# Altium schematic sheet DXP格式 单片机万年历LCD12864显示.SchDoc
size A4
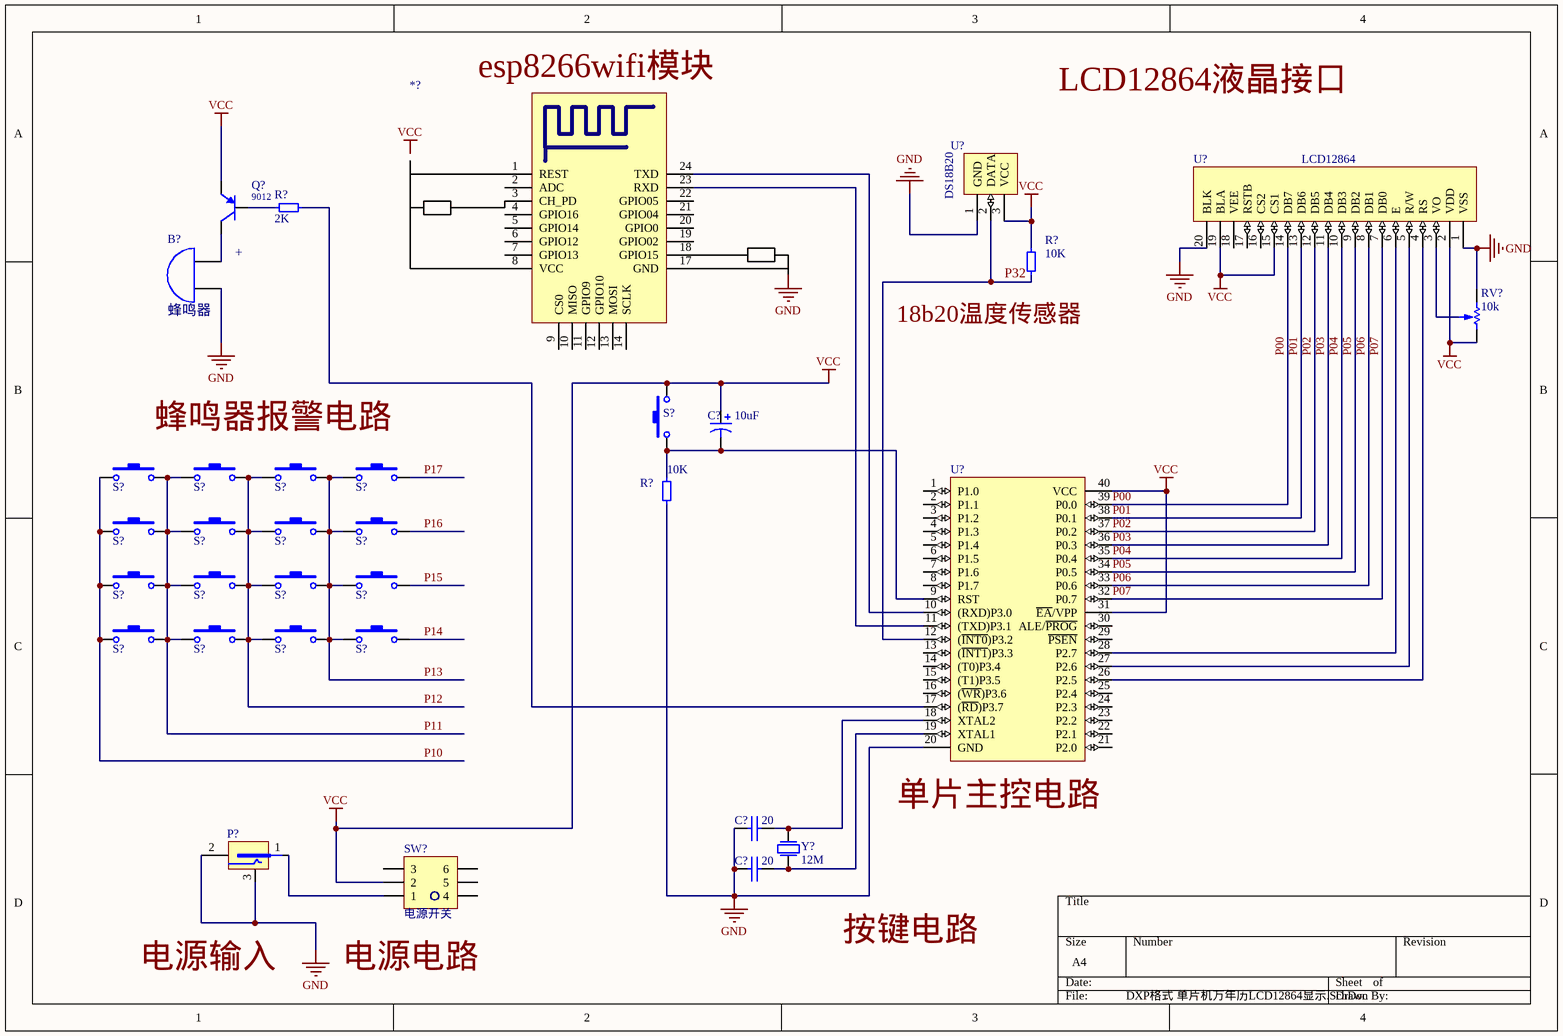
[diagram p0: DXP格式 单片机万年历LCD12864显示.SchDoc]

## Parts
(Parts that share a designator on the sheet are numbered #1, #2 ... from top to bottom, then left to right.)
*?  esp8266wifi模块
B?  蜂鸣器  [Bett]
C?#1  10uF  [C_10]
C?#2  20  [CAP5]
C?#3  20  [CAP5]
P?  电源输入  [DC2.1]  (value not drawn)
Q?  9012  [s三极管直插]
R?#1  2K  [AXIAL0.3]
R?#2  10K  [AXIAL0.3]
R?#3  10K  [res400mil]
RV?  value 10k  [可调电阻器]  (hidden comment: R)
S?#1  SW-PB  [key]  (value not drawn)
S?#2  SW-PB  [key]  (value not drawn)
S?#3  SW-PB  [key]  (value not drawn)
S?#4  SW-PB  [key]  (value not drawn)
S?#5  SW-PB  [key]  (value not drawn)
S?#6  SW-PB  [key]  (value not drawn)
S?#7  SW-PB  [key]  (value not drawn)
S?#8  SW-PB  [key]  (value not drawn)
S?#9  SW-PB  [key]  (value not drawn)
S?#10  SW-PB  [key]  (value not drawn)
S?#11  SW-PB  [key]  (value not drawn)
S?#12  SW-PB  [key]  (value not drawn)
S?#13  SW-PB  [key]  (value not drawn)
S?#14  SW-PB  [key]  (value not drawn)
S?#15  SW-PB  [key]  (value not drawn)
S?#16  SW-PB  [key]  (value not drawn)
S?#17  SW-PB  [key]  (value not drawn)
SW?  电源开关  [sw_自锁 1]
U?#1  DS18B20  [18B20]
U?#2  LCD12864  [SIP20]
U?#3  STC89C52  [DIP40 - 做板]  (value not drawn)
Y?  12M  [XTAL]

## Nets
GND: B?.2(B) C?#2.1 C?#3.1 P?.2 P?.3 R?#3.1 RV?.3 U?#1.1(GND) U?#2.1(VSS) U?#2.20(BLK) U?#3.20(GND)
VCC: C?#1.1 Q?.1(E) R?#2.2 RV?.1 S?#1.2 SW?.2 U?#1.3(VCC) U?#2.2(VDD) U?#2.15(CS1) U?#2.19(BLA) U?#3.31(~{EA}/VPP) U?#3.40(VCC)
P00: U?#2.14(DB7) U?#3.39(P0.0)
P01: U?#2.13(DB6) U?#3.38(P0.1)
P02: U?#2.12(DB5) U?#3.37(P0.2)
P03: U?#2.11(DB4) U?#3.36(P0.3)
P04: U?#2.10(DB3) U?#3.35(P0.4)
P05: U?#2.9(DB2) U?#3.34(P0.5)
P06: U?#2.8(DB1) U?#3.33(P0.6)
P07: U?#2.7(DB0) U?#3.32(P0.7)
P10: S?#2.1 S?#6.1 S?#10.1 S?#14.1
P11: S?#2.2 S?#3.1 S?#6.2 S?#7.1 S?#10.2 S?#11.1 S?#14.2 S?#15.1
P12: S?#3.2 S?#4.1 S?#7.2 S?#8.1 S?#11.2 S?#12.1 S?#15.2 S?#16.1
P13: S?#4.2 S?#5.1 S?#8.2 S?#9.1 S?#12.2 S?#13.1 S?#16.2 S?#17.1
P14: S?#17.2
P15: S?#13.2
P16: S?#9.2
P17: S?#5.2
P32: R?#2.1 U?#1.2(DATA) U?#3.12((~{INT0})P3.2)
Net*?_23: *?.23(RXD) U?#3.11((TXD)P3.1)
Net*?_24: *?.24(TXD) U?#3.10((RXD)P3.0)
NetB?_1: B?.1(A) Q?.3(C)
NetC?#1_2: C?#1.2 R?#3.2 S?#1.1 U?#3.9(RST)
NetC?#2_2: C?#2.2 U?#3.18(XTAL2) Y?.1(P1)
NetC?#3_2: C?#3.2 U?#3.19(XTAL1) Y?.2(P2)
NetP?_1: P?.1 SW?.1
NetQ?_2: Q?.2(B) R?#1.1
NetR?#1_2: R?#1.2 U?#3.17((~{RD})P3.7)
NetRV?_2: RV?.2 U?#2.3(VO)
NetU?#2_4: U?#2.4(RS) U?#3.26(P2.5)
NetU?#2_5: U?#2.5(R/W) U?#3.27(P2.6)
NetU?#2_6: U?#2.6(E) U?#3.28(P2.7)

Not connected (* = marked no-connect by the designer): *? 1(REST) 2(ADC) 3(CH_PD) 4(GPIO16) 5(GPIO14) 6(GPIO12) 7(GPIO13) 8(VCC) 9(CS0) 10(MISO) 11(GPIO9) 12(GPIO10) 13(MOSI) 14(SCLK) 16 17(GND) 18(GPIO15) 19(GPIO02) 20(GPIO0) 21(GPIO04) 22(GPIO05) 25(VCC) 26(GND); SW? 3 4 5 6; U?#2 16(CS2) 17(RSTB) 18(VEE); U?#3 1(P1.0) 2(P1.1) 3(P1.2) 4(P1.3) 5(P1.4) 6(P1.5) 7(P1.6) 8(P1.7) 13((~{INT1})P3.3) 14((T0)P3.4) 15((T1)P3.5) 16((~{WR})P3.6) 21(P2.0) 22(P2.1) 23(P2.2) 24(P2.3) 25(P2.4) 29(~{PSEN}) 30(ALE/~{PROG})

## Notes on the sheet
- +
- Labels drawn without touching a wire or pin: 18b20温度传感器, GND, LCD12864液晶接口, VCC, 单片主控电路, 按键电路, 电源电路, 电源输入, 蜂鸣器报警电路
- (in symbol Component_2) 1K

## Library data of the parts
*? = Component_2
B? = BELL
C?#1 = Cap Pol1: Polarized Capacitor (Radial); Published: 8-Jun-2000; LatestRevisionDate: 17-Jul-2002; LatestRevisionNote: Re-released for DXP Platform.; PackageReference: RB7.6-15; Publisher: Altium Limited
C?#2 C?#3 = CAP: 电容
P? = POWER
Q? = 2N3906: PNP General Purpose Amplifier; Published: 8-Jun-2000; LatestRevisionDate: 15-Jan-2003; LatestRevisionNote: PCB Footprint 'BCY-W3/D4.7' replaced; DatasheetDocument: 1997; PackageDocument: Sep-1998; PackageReference: TO-92A; Publisher: Altium Limited; Code_JEDEC: TO-92A; ComponentLink1Description: Manufacturer Link; ComponentLink1URL: http://www.fairchildsemi.com/; ComponentLink2Description: Datasheet; ComponentLink2URL: http://www.fairchildsemi.com/ds/2N%2F2N3906.pdf
R?#1-R?#3 = RES2
RV? = R: 可变电阻
S?#1-S?#17 = SW-PB: Switch; Published: 24-Mar-1999; LatestRevisionDate: 17-Jul-2002; LatestRevisionNote: Re-released for DXP Platform.; PackageReference: SPST-2; Publisher: Altium Limited
SW? = SW1
U?#2 = LCD12864_1
U?#3 = U1
Y? = 16M: Crystal Oscillator